# EAGLE design Reverse Geocache schematic v1.1 (EAGLE 5.11)
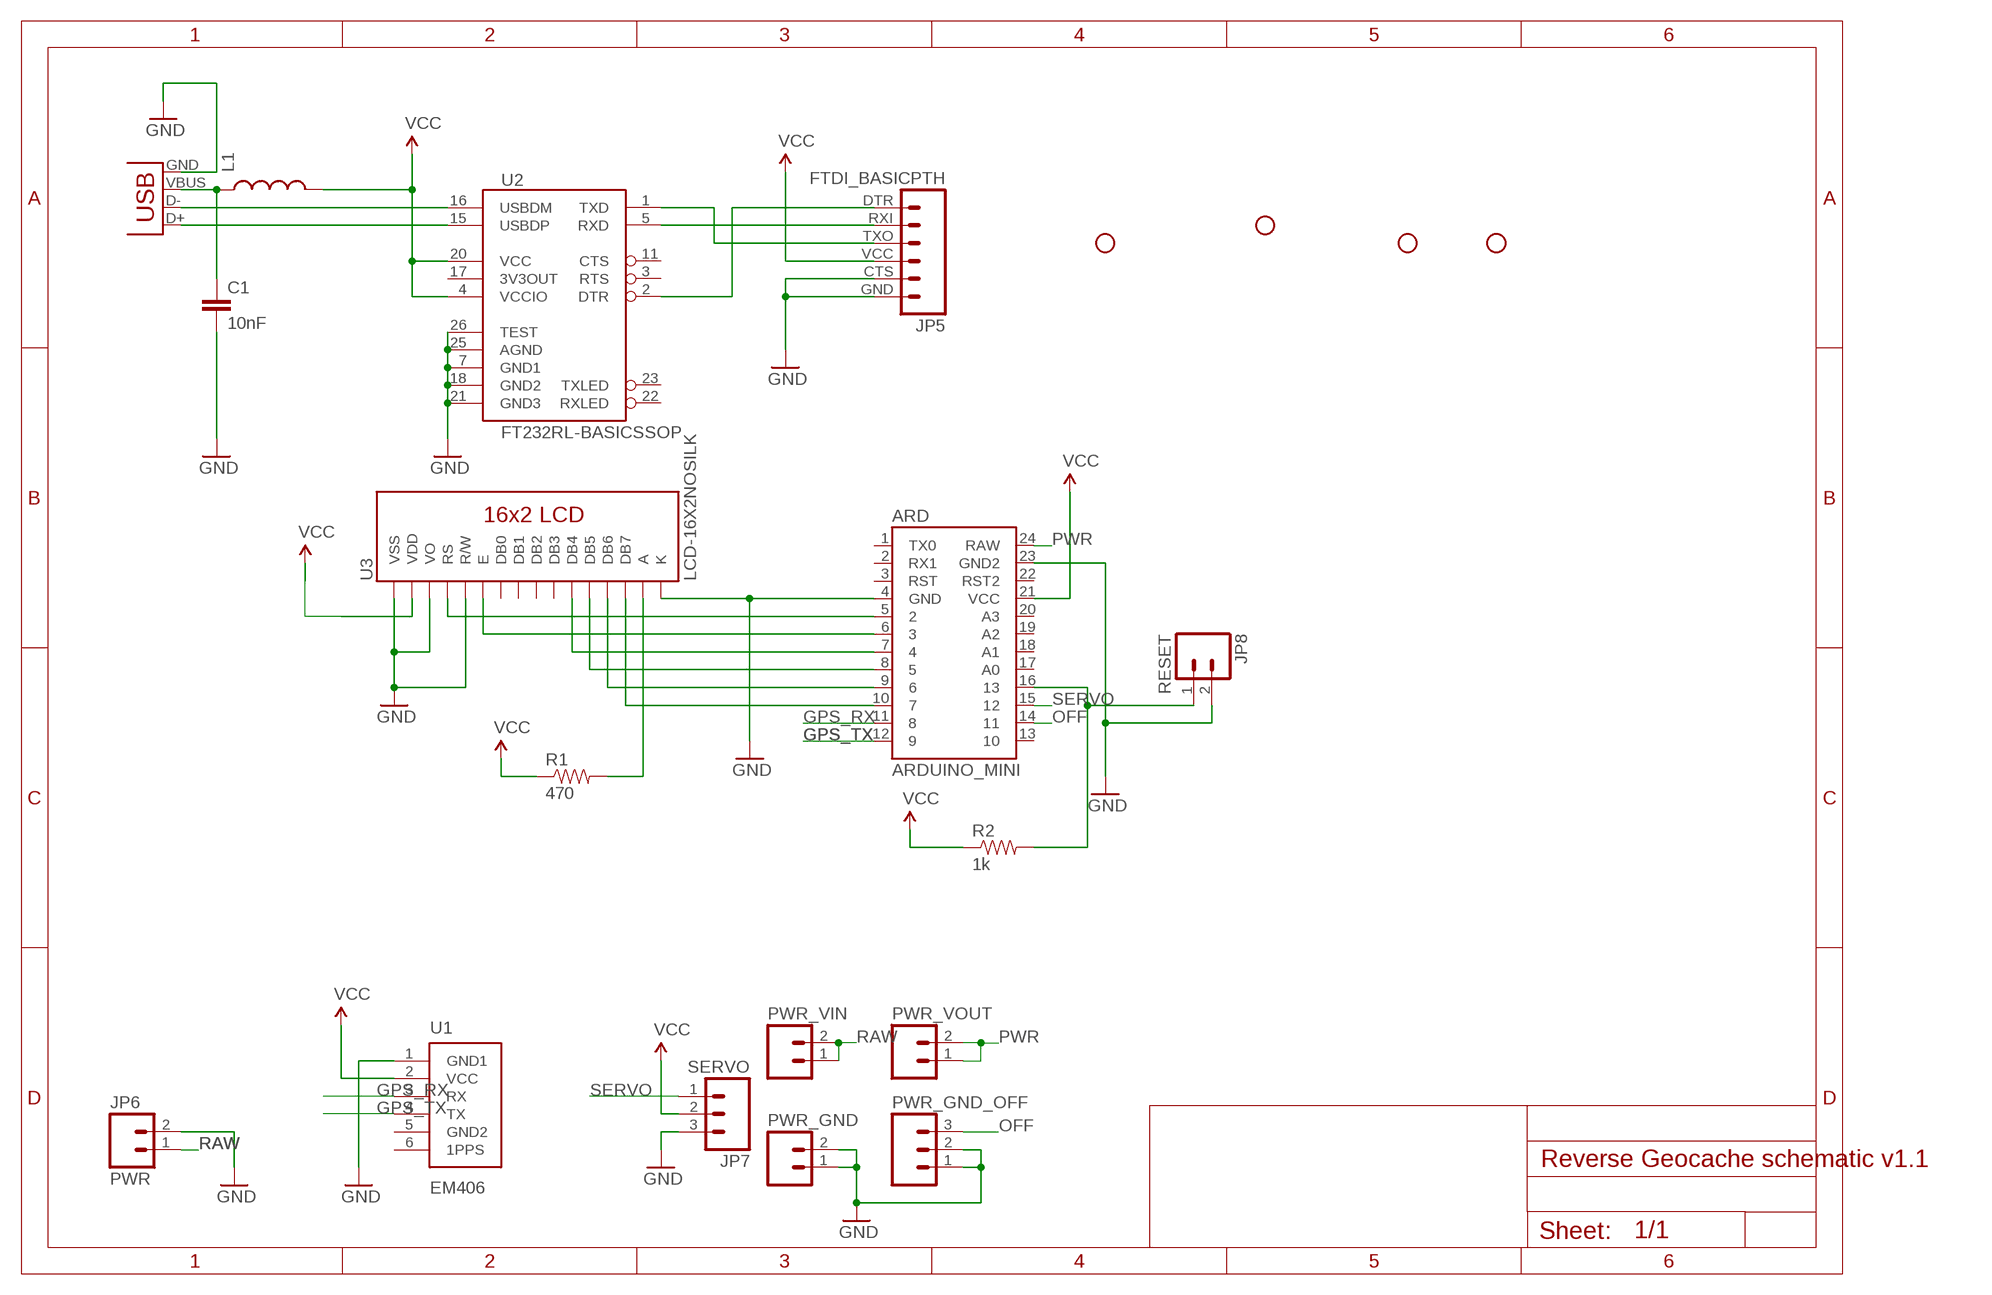
[diagram p0: schematic, sheet 1]

## Parts
ARD  ARDUINO_MINI  [ARDUINO_MINI]
C1  10nF  CAP0603-CAP  [0603-CAP]
JP1  STAND-OFF  [STAND-OFF]
JP2  STAND-OFF  [STAND-OFF]
JP3  STAND-OFF  [STAND-OFF]
JP4  STAND-OFF  [STAND-OFF]
JP5  FTDI_BASICPTH  [FTDI_BASIC]
JP6  PWR  M02POLAR  [MOLEX-1X2]
JP7  SERVO  M03PTH  [1X03]
JP8  RESET  M02PTH  [1X02]
L1  INDUCTOR0603  [0603]
PWR_GND  M02PTH  [1X02]
PWR_GND_OFF  M03PTH  [1X03]
PWR_VIN  M02PTH  [1X02]
PWR_VOUT  M02PTH  [1X02]
R1  470  RESISTORPTH-1/4W  [AXIAL-0.4]
R2  1k  RESISTORPTH-1/4W  [AXIAL-0.4]
U1  EM406  [EM406]
U2  FT232RL-BASICSSOP  [SSOP28DB]
U3  LCD-16X2NOSILK  [LCD-16X2_NOSILK]
X1  USBPTH-VERTICAL  [USB-B-PTH-VERTICAL]

## Nets
GND: ARD.4(GND) ARD.23(GND2) C1.2 JP5.CTS JP5.GND JP6.2 JP7.3 JP8.2 PWR_GND.1 PWR_GND.2 PWR_GND_OFF.1 PWR_GND_OFF.2 U1.1(GND1) U2.7(GND1) U2.18(GND2) U2.21(GND3) U2.25(AGND) U2.26(TEST) U3.1(VSS) U3.3(VO) U3.5(R/W) U3.16(K) X1.GND
GPS_RX: ARD.11 U1.3(RX)
GPS_TX: ARD.12 U1.4(TX)
N$1: U2.16(USBDM) X1.D-
N$2: U2.15(USBDP) X1.D+
N$3: C1.1 L1.1 X1.VBUS
N$4: ARD.5 U3.4(RS)
N$5: JP5.TXO U2.1(TXD)
N$6: JP5.RXI U2.5(RXD)
N$8: JP5.DTR U2.2(DTR)
N$10: R1.P$2 U3.15(A)
N$11: ARD.16 JP8.1 R2.P$2
N$12: ARD.6 U3.6(E)
N$13: ARD.7 U3.11(DB4)
N$14: ARD.8 U3.12(DB5)
N$15: ARD.9 U3.13(DB6)
N$16: ARD.10 U3.14(DB7)
OFF: ARD.14 PWR_GND_OFF.3
PWR: ARD.24(RAW) PWR_VOUT.1 PWR_VOUT.2
RAW: JP6.1 PWR_VIN.1 PWR_VIN.2
SERVO: ARD.15 JP7.1
VCC: ARD.21(VCC) JP5.VCC JP7.2 L1.2 R1.P$1 R2.P$1 U1.2(VCC) U2.4(VCCIO) U2.20(VCC) U3.2(VDD)
Unconnected: ARD.1(TX0) ARD.2(RX1) ARD.3(RST) ARD.13 ARD.17(A0) ARD.18(A1) ARD.19(A2) ARD.20(A3) ARD.22(RST2) U1.5(GND2) U1.6(1PPS) U2.3(RTS) U2.11(CTS) U2.17(3V3OUT) U2.22(RXLED) U2.23(TXLED) U3.7(DB0) U3.8(DB1) U3.9(DB2) U3.10(DB3)

## Library data of the parts
ARD = SparkFun:ARDUINO_MINI
C1 = SparkFun:CAP: Capacitor Standard 0603 ceramic capacitor, and 0.1" leaded capacitor.
JP1-JP4 = SparkFun:STAND-OFF: Stand Off This is the mechanical footprint for a #4 phillips button head screw. Use the keepout ring to avoid running the screw head into surrounding components. SKU : PRT-00447
JP5 = SparkFun:FTDI_BASIC: FTDI Basic: 3.3V and 5V
JP6 JP8 PWR_GND PWR_VIN PWR_VOUT = SparkFun:M02: Header 2 Standard 2-pin 0.1" header. Use with straight break away headers (SKU : PRT-00116), right angle break away headers (PRT-00553), swiss pins (PRT-00743), machine pins (PRT-00117), and female headers (PRT-00115). Molex polarized connector foot print use with SKU : PRT-08233 with associated crimp pins and housings.
JP7 PWR_GND_OFF = SparkFun:M03: Header 3 Standard 3-pin 0.1" header. Use with straight break away headers (SKU : PRT-00116), right angle break away headers (PRT-00553), swiss pins (PRT-00743), machine pins (PRT-00117), and female headers (PRT-00115). Molex polarized connector foot print use with SKU : PRT-08232 with associated crimp pins and housings.
L1 = SparkFun:INDUCTOR: Inductors Basic Inductor/Choke - 0603 and 1206. Footprints are not proven and vary greatly between part numbers.
R1 R2 = SparkFun:RESISTOR: Resistor Basic schematic elements and footprints for 0603, 1206, and PTH resistors.
U1 = SparkFun:EM406: EM406 Connector Proven layout and schematic for EM406 connector. Spark Fun Electronics SKU : GPS-00579
U2 = SparkFun:FT232RL-BASIC: USB UART This is the simplified version of the FT232RL unit. Only what you need, nothing you don't. Spark Fun Electronics SKU : COM-00650
U3 = SparkFun:LCD-16X2
X1 = SparkFun:USB: USB Connectors USB-B-PTH is fully proven SKU : PRT-00139 USB-miniB is fully proven SKU : PRT-00587 USB-A-PCB is untested. USB-A-H is throughly reviewed, but untested. Spark Fun Electronics SKU : PRT-00437 USB-B-SMT is throughly reviewed, but untested. Needs silkscreen touching up. USB-A-S has not been used/tested USB-MB-H has not been used/tested

## Board
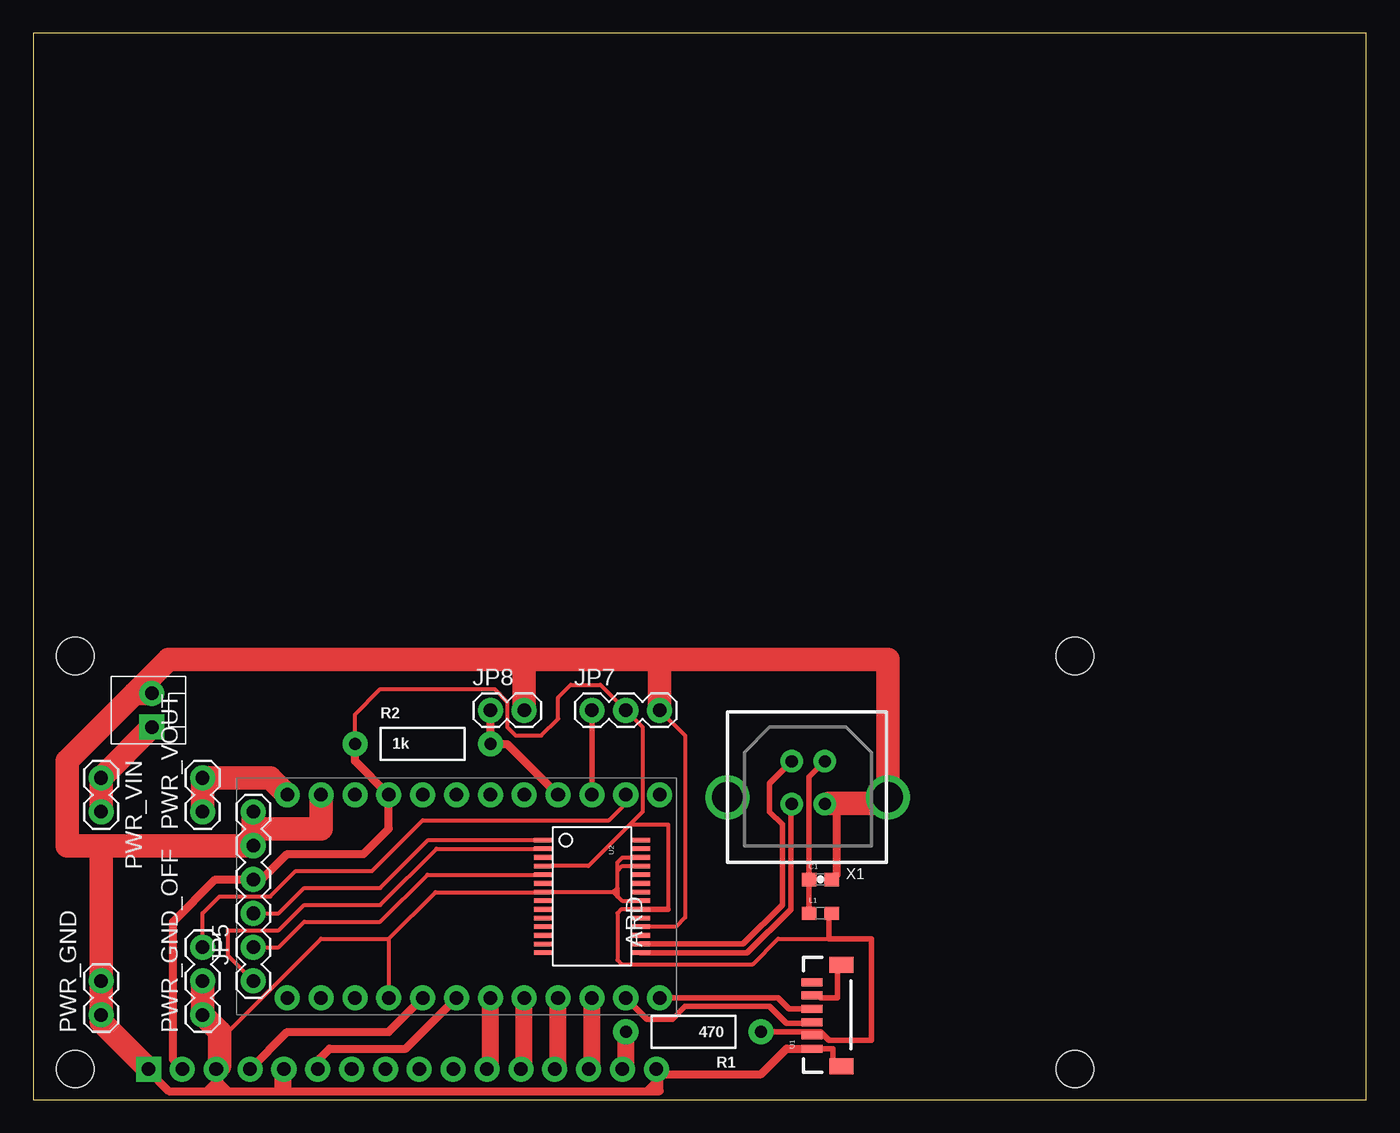
[diagram p1: board, top side]

Size 100 x 80 mm. Coordinates in mm from the lower left corner, seen from the top.
Outline: 0,0 100,0 100,80 0,80 0,0
Copper layers (1*16): Top 0.035mm / dielectric 1.5mm / Bottom 0.035mm
Design rules "default": minimum track width 10mil, minimum drill 24mil, track to track 8mil, track to pad 8mil, pad to pad 8mil, via to via 8mil, smd to smd 8mil, copper to edge 40mil, drill to drill 8mil, minimum pad ring 10mil, minimum via ring 8mil, stop-mask expansion 4mil, vias tented up to drill 0mil, thermal gap 10mil

### Footprints (pad centres in the part's own frame; a part is rotated, then mirrored left to right if it is on the bottom)
ARDUINO_MINI = drill 1.016 pad 1.88 round: 1 -7.62,12.7; 2 -7.62,10.16; 3 -7.62,7.62; 4 -7.62,5.08; 5 -7.62,2.54; 6 -7.62,0; 7 -7.62,-2.54; 8 -7.62,-5.08; 9 -7.62,-7.62; 10 -7.62,-10.16; 11 -7.62,-12.7; 12 -7.62,-15.24; 13 7.62,-15.24; 14 7.62,-12.7; 15 7.62,-10.16; 16 7.62,-7.62; 17 7.62,-5.08; 18 7.62,-2.54; 19 7.62,0; 20 7.62,2.54; 21 7.62,5.08; 22 7.62,7.62; 23 7.62,10.16; 24 7.62,12.7
0603-CAP = smd 1.1 x 1: 1 -0.85,0; 2 0.85,0
STAND-OFF = hole 3.302: 0,0
FTDI_BASIC = drill 1.016 pad 1.88 round: CTS 10.16,0; DTR 0,0; GND 12.7,0; RXI 2.54,0; TXO 5.08,0; VCC 7.62,0
MOLEX-1X2 = drill 1.016 pad 1.88 square: 1 0,0 | drill 1.016 pad 1.88 round: 2 2.54,0
1X03 = drill 1.016 pad 1.88 round: 1 0,0; 2 2.54,0; 3 5.08,0
1X02 = drill 1.016 pad 1.88 round: 1 0,0; 2 2.54,0
0603 = smd 1.1 x 1: 1 -0.85,0; 2 0.85,0
AXIAL-0.4 = drill 0.9 pad 1.88 round: P$1 -5.08,0; P$2 5.08,0
EM406 = smd 0.6 x 1.55: 1 0,0; 2 1,0; 3 2,0; 4 3,0; 5 4,0; 6 5,0 | smd 1.2 x 1.8: P$1 -1.3,-2.225; P$2 6.3,-2.225
SSOP28DB = smd 0.348 x 1.397: 1 -4.225,-3.656; 2 -3.575,-3.656; 3 -2.925,-3.656; 4 -2.275,-3.656; 5 -1.625,-3.656; 6 -0.975,-3.656; 7 -0.325,-3.656; 8 0.325,-3.656; 9 0.975,-3.656; 10 1.625,-3.656; 11 2.275,-3.656; 12 2.925,-3.656; 13 3.575,-3.656; 14 4.225,-3.656; 15 4.225,3.656; 16 3.575,3.656; 17 2.925,3.656; 18 2.275,3.656; 19 1.625,3.656; 20 0.975,3.656; 21 0.325,3.656; 22 -0.325,3.656; 23 -0.975,3.656; 24 -1.625,3.656; 25 -2.275,3.656; 26 -2.925,3.656; 27 -3.575,3.656; 28 -4.225,3.656
LCD-16X2_NOSILK = drill 1.016 pad 1.88 square: 1 -32,15.5 | drill 1.016 pad 1.88 round: 2 -29.46,15.5; 3 -26.92,15.5; 4 -24.38,15.5; 5 -21.84,15.5; 6 -19.3,15.5; 7 -16.76,15.5; 8 -14.22,15.5; 9 -11.68,15.5; 10 -9.14,15.5; 11 -6.6,15.5; 12 -4.06,15.5; 13 -1.52,15.5; 14 1.02,15.5; 15 3.56,15.5; 16 6.1,15.5 | hole 2.8: -37.5,15.5; -37.5,-15.5; 37.5,15.5; 37.5,-15.5
USB-B-PTH-VERTICAL = drill 0.914 pad 1.676 round: D+ 4.826,4.394; D- 4.826,7.595; GND 7.315,4.394; VBUS 7.315,7.595 | drill 2.286 round: P$1 0,4.902; P$2 12.04,4.902

### Placement (x,y rotation side)
ARD  31.75,15.24 90 top
C1  59.05,16.51 0 top
JP1  -43.18,74.93 0 top  (outside the outline)
JP2  -49.53,74.93 0 top  (outside the outline)
JP3  -55.88,74.93 0 top  (outside the outline)
JP4  -62.23,74.93 0 top  (outside the outline)
JP5  16.51,8.89 90 top
JP6  8.89,27.94 90 top
JP7  41.91,29.21 0 top
JP8  34.29,29.21 0 top
L1  59.05,13.97 0 top
PWR_GND  5.08,6.35 90 top
PWR_GND_OFF  12.7,6.35 90 top
PWR_VIN  5.08,24.13 270 top
PWR_VOUT  12.7,21.59 90 top
R1  49.53,5.08 180 top
R2  29.21,26.67 0 top
U1  58.42,3.81 90 top
U2  41.91,15.24 270 top
U3  40.64,17.78 180 bottom
X1  52.07,17.78 0 top

### Tracks (layer width: path | path; a pad name or v marks a point on that pad's centre or on a via)
GND
  Top 0.305: 43.51,15.56 U2.7 30.16,15.56 26.67,12.06 | 43.51,15.56 43.81,15.88 | U2.21 44.16,14.91 43.51,15.56 | U2.25 44.19,17.52 43.81,17.14 | 43.81,15.88 43.81,17.14 | U2.26 44.2,18.16 43.81,17.78 43.81,17.14 | 13.97,5.08 14.61,5.08 21.59,12.06 26.67,12.06 | 26.67,12.06 ARD.4 | U2.18 48.21,12.96 48.9,13.65 48.9,27.3 JP7.3 | 43.81,15.88 43.81,15.24
  Top 0.61: 13.97,2.54 13.97,1.27 14.61,0.64 | 14.61,0.64 18.41,0.64 | 18.41,0.64 46.04,0.64 | 46.04,0.64 46.67,0.64 | 46.67,0.64 46.99,0.64 46.99,1.91 | 18.41,0.64 18.41,1.91 18.73,2.22 | U3.5 18.73,2.22 | U1.1 56.52,3.81 54.61,1.91 46.99,1.91 | 46.99,1.91 46.99,2.22 | 46.99,2.22 46.99,2.54 | 60.27,22.17 X1.GND | 60.33,22.23 60.27,22.17 | 60.27,22.17 60.27,16.88 C1.2 | 13.02,0.64 10.16,0.64 8.57,2.22 U3.1 | 13.65,0.64 14.61,0.64 | 13.65,2.22 13.65,1.27 13.02,0.64 | 13.02,0.64 13.65,0.64 | 13.65,0.64 13.97,0.95 | 18.73,2.22 19.05,1.91 19.05,0.95 18.73,0.95 18.73,1.59 | 46.67,0.64 46.74,0.7 U3.16 46.93,2.28 46.99,2.22 | 46.99,1.91 46.67,1.91 46.67,1.27 46.04,0.64
  Top 1.27: 13.97,2.54 13.97,2.53 U3.3
  Top 1.778: PWR_GND_OFF.2 PWR_GND_OFF.1 13.97,5.08 13.97,2.54 | 16.51,20.32 JP5.CTS 5.08,19.05 | 16.51,20.32 JP5.GND | 7.62,30.48 JP6.2 | 7.62,30.48 2.54,25.4 2.54,19.05 5.08,19.05 | 16.51,20.32 21.59,20.32 ARD.23 | 7.62,30.48 10.16,33.02 36.83,33.02 | 36.83,33.02 JP8.2 | 36.83,33.02 46.99,33.02 | 46.99,33.02 JP7.3 | 46.99,33.02 64.14,33.02 64.14,22.23 60.33,22.23 59.69,22.23 | 5.08,19.05 PWR_GND.2 PWR_GND.1 5.08,5.84 U3.1
GPS_RX
  Top 0.406: U1.3 58.33,5.71 56.52,5.71 55.24,6.99 48.9,6.99 47.94,6.03 46.04,6.03 44.77,7.3 44.77,7.62 ARD.11
GPS_TX
  Top 0.406: U1.4 56.69,6.81 55.88,7.62 ARD.12
N$1
  Top 0.406: U2.16 53.26,11.66 56.2,14.61 56.2,20.64 55.24,21.59 55.24,23.72 X1.D-
N$2
  Top 0.406: U2.15 53.56,11.02 56.83,14.29 56.83,22.11 X1.D+
N$3
  Top 0.406: L1.1 C1.1 58.2,24.19 X1.VBUS
N$4
  Top 0.61: ARD.5 26.67,5.08 19.06,5.08 U3.4
N$5
  Top 0.305: U2.1 29.62,19.46 26.04,15.88 20.32,15.88 18.41,13.97 JP5.TXO
N$6
  Top 0.305: JP5.RXI 18.41,11.43 20.32,13.34 26.04,13.34 29.57,16.86 U2.5
N$7
  Top 0.406: 60.33,9.53 60.33,7.62 59.05,7.62
N$8
  Top 0.305: U2.2 30.25,18.82 26.04,14.61 20.32,14.61 18.41,12.7 14.61,12.7 14.61,10.79 JP5.DTR
N$9
  Top 0.406: 58.74,3.81 60.01,3.81 60.01,2.54
N$10
  Top 1.27: R1.P$2 44.45,2.54 U3.15
N$11
  Top 0.61: JP8.1 R2.P$2 35.56,26.67 ARD.16
N$12
  Top 0.61: U3.6 21.34,2.92 22.23,3.81 27.94,3.81 ARD.6
N$13
  Top 1.27: ARD.7 34.29,2.53 U3.11
N$14
  Top 1.27: ARD.8 36.83,2.53 U3.12
N$15
  Top 1.27: ARD.9 39.37,2.53 U3.13
N$16
  Top 1.27: ARD.10 41.91,2.53 U3.14
OFF
  Top 0.305: PWR_GND_OFF.3 12.7,13.97 13.97,15.24 17.78,15.24 19.68,17.14 25.4,17.14 29.21,20.95 43.18,20.95 44.45,22.23 ARD.14
PWR
  Top 1.778: PWR_VOUT.1 PWR_VOUT.2 17.78,24.13 ARD.24
RAW
  Top 1.778: PWR_VIN.2 PWR_VIN.1 JP6.1
SERVO
  Top 0.406: ARD.15 JP7.1
VCC
  Top 0.305: U2.4 41.65,17.52 44.77,20.64 | 44.77,20.64 45.72,21.59 45.72,27.94 JP7.2 42.55,31.11 40.32,31.11 39.37,30.16 39.37,28.57 38.1,27.3 36.2,27.3 35.56,27.94 35.56,29.84 34.61,30.8 26.04,30.8 24.13,28.89 24.13,25.4 | 44.77,20.64 47.62,20.64 47.62,14.27 44.11,14.27 43.81,13.97 43.81,10.48 44.13,10.16 53.98,10.16 55.88,12.06 60.01,12.06
  Top 0.406: 47.62,14.27 U2.20 | L1.2 59.69,13.76 59.69,12.06 60.01,12.06 62.87,12.06 62.87,4.45 59.69,4.45 59.05,5.08 58.42,5.08 | 58.42,5.08 R1.P$1 | 58.42,5.08 U1.2
  Top 0.61: R2.P$1 24.13,25.4 ARD.21 26.67,20.32 24.77,18.41 19.05,18.41 17.14,16.51 JP5.VCC 13.65,16.51 10.48,13.34 10.48,2.98 U3.2